# Altium project Portable Power Source V1.0.PrjPcb
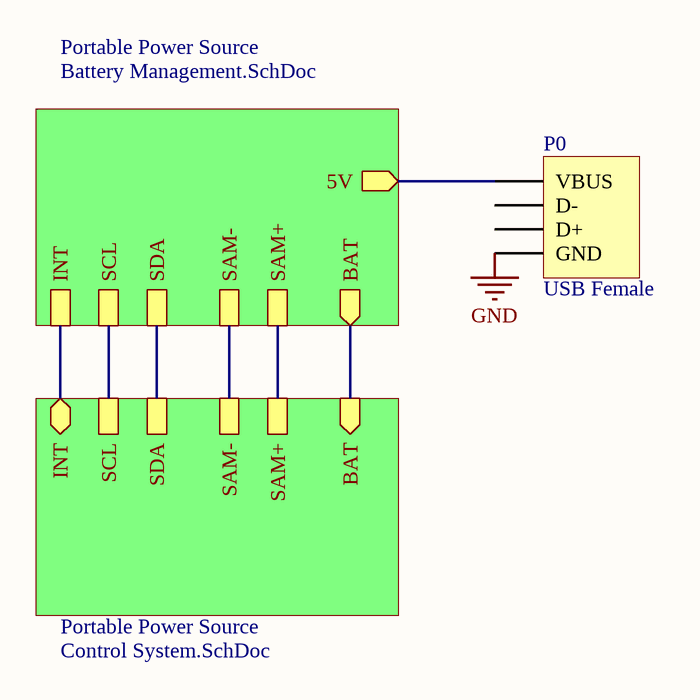
[diagram p0: Portable Power Source.SchDoc]
3 sheets, 57 parts. Net scope: hierarchical (ports join the sheet entries above them; power ports are global).
Board file: Portable Power Bank.PcbDoc
Sheets:
  Portable Power Source.SchDoc
    Portable Power Source = Battery Management.SchDoc
    Portable Power Source = Control System.SchDoc

## Sheet Portable Power Source.SchDoc
size A4

### Parts
P0  USB Female  [USB Female]

### Sub-sheets
Portable Power Source = Battery Management.SchDoc: SDA, SCL, INT, 5V (out), BAT (out), SAM-, SAM+
Portable Power Source = Control System.SchDoc: BAT (in), SCL, SDA, SAM-, SAM+, INT

### Nets
GND: P0.4(GND)
BAT: sheet Portable Power Source/BAT, sheet Portable Power Source/BAT
INT: sheet Portable Power Source/INT, sheet Portable Power Source/INT
SCL: sheet Portable Power Source/SCL, sheet Portable Power Source/SCL
SDA: sheet Portable Power Source/SDA, sheet Portable Power Source/SDA
NetC8_2: sheet Portable Power Source/SAM+, sheet Portable Power Source/SAM+
NetP0_1: P0.1(VBUS) ; sheet Portable Power Source/5V, sheet Portable Power Source/SAM-, sheet Portable Power Source/SAM-

Not connected (* = marked no-connect by the designer): P0 2(D-) 3(D+)

## Sheet Battery Management.SchDoc
size A4
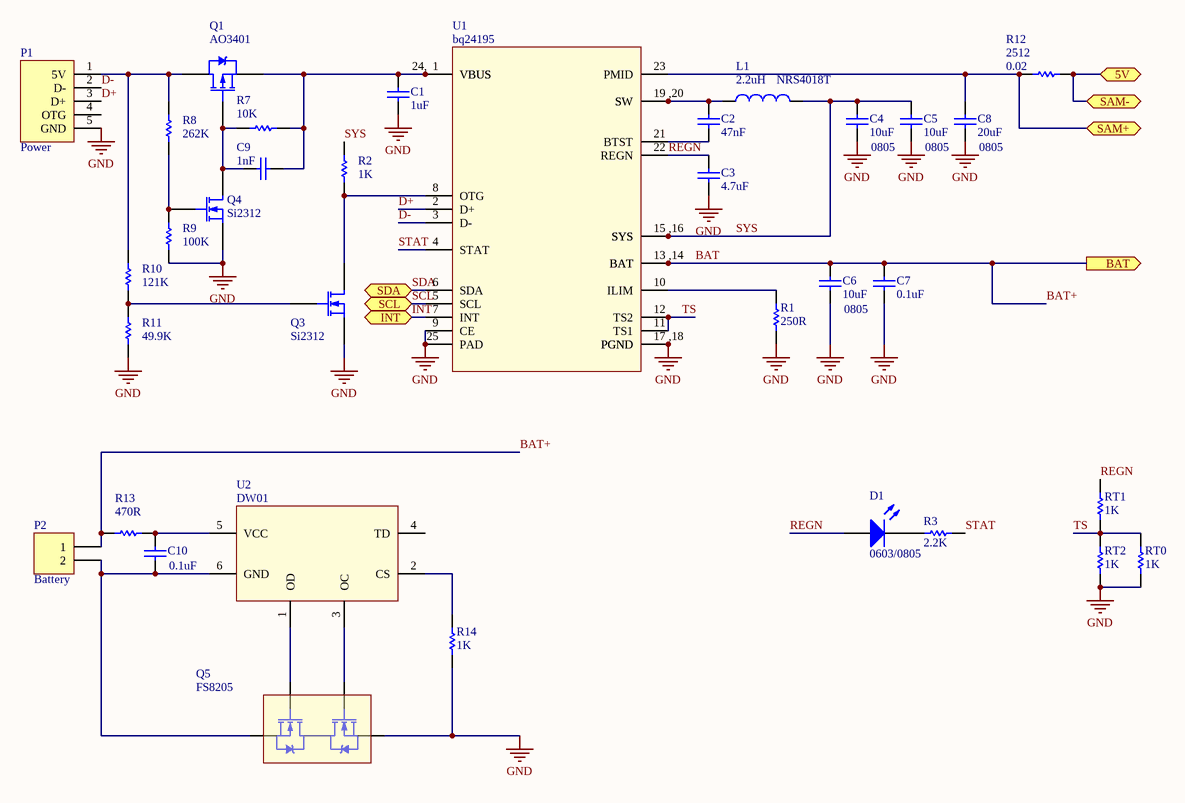
[diagram p1: Battery Management.SchDoc]

### Parts
(Parts that share a designator on the sheet are numbered #1, #2 ... from top to bottom, then left to right.)
C1#1  value 1uF  [D0805]  (hidden comment: 0603)
C2#1  value 47nF  [D0805]  (hidden comment: 0603)
C3#1  value 4.7uF  [D0603]  (hidden comment: 0603)
C4#1  0805  value 10uF  [D0805]
C5  0805  value 10uF  [D0805]
C6  0805  value 10uF  [D0805]
C7  value 0.1uF  [D0603]  (hidden comment: 0603)
C8  0805  value 20uF  [D0805]
C9  value 1nF  [D0603]  (hidden comment: 0603)
C10  value 0.1uF  [D0603]  (hidden comment: 0603)
D1#1  0603/0805  [D0805_Diode]
L1  value 2.2uH  CommentType: NRS4018T  [INDUCTOR.4040]  (hidden comment: Inductor)
P1#1  Power  [Micro.Horn]
P2  Battery  [BAT_RECT]
Q1  AO3401  [SOT23]
Q3  Si2312  [SOT23]
Q4  Si2312  [SOT23]
Q5  FS8205  [SOT23-6_N]
R1#1  value 250R  [D0603]  (hidden comment: 0603)
R2#1  value 1K  [D0603]  (hidden comment: 0603)
R3#1  value 2.2K  [D0603]  (hidden comment: 0603)
R7#1  value 10K  [D0603]  (hidden comment: 0603)
R8#1  value 262K  [D0603]  (hidden comment: 0603)
R9#1  value 100K  [D0603]  (hidden comment: 0603)
R10#1  value 121K  [D0603]  (hidden comment: 0603)
R11  value 49.9K  [D0603]  (hidden comment: 0603)
R12  2512  value 0.02  [D1206]
R13  value 470R  [D0603]  (hidden comment: 0603)
R14  value 1K  [D0603]  (hidden comment: 0603)
RT0  value 1K  [D0603]  (hidden comment: 0603)
RT1  value 1K  [D0603]  (hidden comment: 0603)
RT2  value 1K  [D0603]  (hidden comment: 0603)
U1#1  bq24195  [QFN24]
U2#1  DW01  [SOT23-6_N]

### Ports
5V, BAT (out), INT, SAM+, SAM-, SCL, SDA

### Nets
GND: C1#1.1 C3#1.1 C4#1.1 C5.1 C6.1 C7.1 C8.1 P1#1.5(GND) Q3.3(S) Q4.3(S) Q5.3(S2) R1#1.1 R9#1.1 R11.1 R14.1 RT0.1 RT2.1 U1#1.9(CE) U1#1.17(PGND) U1#1.18(PGND) U1#1.25(PAD)
BAT: C6.2 C7.2 P2.1 R13.1 U1#1.13(BAT) U1#1.14(BAT) ; port BAT  [also labelled BAT+]
D+: P1#1.3(D+) U1#1.2(D+)
D-: P1#1.2(D-) U1#1.3(D-)
INT: U1#1.7(INT) ; port INT
REGN: C3#1.2 D1#1.1(A) RT1.2 U1#1.22(REGN)
SCL: U1#1.5(SCL) ; port SCL
SDA: U1#1.6(SDA) ; port SDA
STAT: R3#1.1 U1#1.4(STAT)
SYS: C4#1.2 C5.2 L1.2 R2#1.2 U1#1.15(SYS) U1#1.16(SYS)
TS: RT0.2 RT1.1 RT2.2 U1#1.11(TS1) U1#1.12(TS2)
NetC1#1_2: C1#1.2 C9.1 Q1.3(S) R7#1.1 U1#1.1(VBUS) U1#1.24(VBUS)
NetC2#1_1: C2#1.1 U1#1.21(BTST)
NetC2#1_2: C2#1.2 L1.1 U1#1.19(SW) U1#1.20(SW)
NetC8_2: C8.2 R12.2 U1#1.23(PMID) ; port SAM+
NetC9_2: C9.2 Q1.1(G) Q4.2(D) R7#1.2
NetC10_1: C10.1 P2.2 Q5.1(S1) U2#1.6(GND)
NetC10_2: C10.2 R13.2 U2#1.5(VCC)
NetD1#1_2: D1#1.2(K) R3#1.2
NetP0_1: R12.1 ; port 5V, port SAM-
NetP1#1_1: P1#1.1(5V) Q1.2(D) R8#1.2 R10#1.2
NetQ3_1: Q3.1(G) R10#1.1 R11.2
NetQ3_2: Q3.2(D) R2#1.1 U1#1.8(OTG)
NetQ4_1: Q4.1(G) R8#1.1 R9#1.2
NetQ5_4: Q5.4(G2) U2#1.3(OC)
NetQ5_6: Q5.6(G1) U2#1.1(OD)
NetR1#1_2: R1#1.2 U1#1.10(ILIM)
NetR14_2: R14.2 U2#1.2(CS)

Not connected (* = marked no-connect by the designer): P1#1 4(OTG); Q5 2(D12) 5(D12); U2#1 4(TD)

### Notes on the sheet
- (in symbol bq24195) 24,; ,20; ,16; ,14; ,18

### Library data of the parts
C1#1 C2#1 C3#1 C4#1 C5-C10 = Cap: Capacitor; Published: 8-Jun-2000; LatestRevisionDate: 17-Jul-2002; LatestRevisionNote: Re-released for DXP Platform.; PackageReference: RAD-0.3; Publisher: Altium Limited; PackageDescription: Radial Cap, Thru-Hole; 2 Leads; 0.3 in Pin Spacing
D1#1 = LED0: Typical INFRARED GaAs LED; Published: 8-Jun-2000; LatestRevisionDate: 08-Jul-2005; LatestRevisionNote: Mech Layer 1 removed.; PackageReference: LED-0; Publisher: Altium Limited; PackageDescription: LED; 2 Leads
L1 = Inductor: Code_IEC: 1005; Published: 8-Jun-2000; LatestRevisionDate: 29-May-2009; LatestRevisionNote: IPC-7351 Footprint Added.; PackageReference: 0402-A; Publisher: Altium Limited; PackageDescription: Chip Inductor; Code_JEITA: 0402
P1#1 = Micro USB Horn: MIcro USB Connector Horn
P2 = Header 2: Header, 2-Pin; LatestRevisionDate: 17-Jul-2002; LatestRevisionNote: Re-released for DXP Platform.; Publisher: Altium Limited
Q1 = AO3401: AO3401 P-Channel MOSFET
Q3 Q4 = Si2312: SI2312 N-Channel MOSFEt
Q5 = FS8205: FS8205 Dual MOS
R1#1 R2#1 R3#1 R7#1 R8#1 R9#1 R10#1 R11-R14 RT0-RT2 = Res1: Resistor; Published: 8-Jun-2000; LatestRevisionDate: 17-Jul-2002; LatestRevisionNote: Re-released for DXP Platform.; PackageReference: AXIAL-0.3; Publisher: Altium Limited; PackageDescription: Axial Device, Thru-Hole; 2 Leads; 0.3 in Pin Spacing
U1#1 = bq24195: A Battery charger manager published by Ti
U2#1 = DW01: Battery Protector

## Sheet Control System.SchDoc
size A4
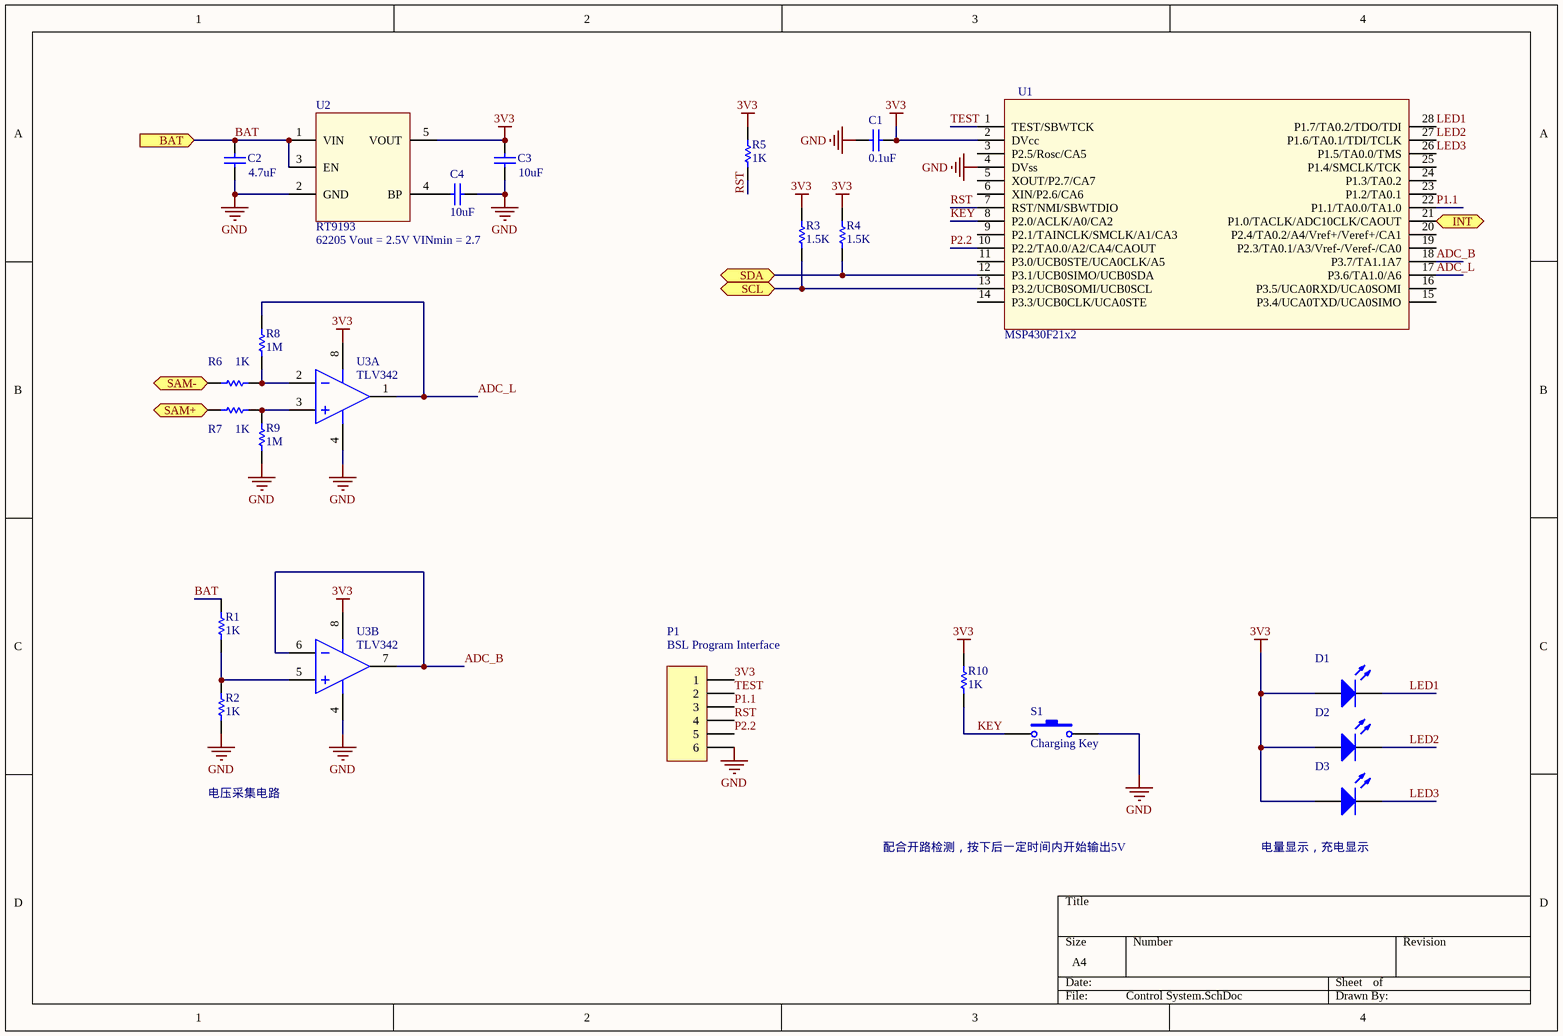
[diagram p2: Control System.SchDoc]

### Parts
(Parts that share a designator on the sheet are numbered #1, #2 ... from top to bottom, then left to right.)
C1#2  value 0.1uF  [D0603]  (hidden comment: 0603)
C2#2  value 4.7uF  [D0603]  (hidden comment: 0603)
C3#2  value 10uF  [D0603]  (hidden comment: 0603)
C4#2  value 10uF  [D0603]  (hidden comment: 0603)
D1#2  0603/0805  [D0805_Diode]  (value not drawn)
D2  0603/0805  [D0805_Diode]  (value not drawn)
D3  0603/0805  [D0805_Diode]  (value not drawn)
P1#2  BSL Program Interface  [HDR1X6]
R1#2  value 1K  [D0603]  (hidden comment: 0603)
R2#2  value 1K  [D0603]  (hidden comment: 0603)
R3#2  value 1.5K  [D0603]  (hidden comment: 0603)
R4  value 1.5K  [D0603]  (hidden comment: 0603)
R5  value 1K  [D0603]  (hidden comment: 0603)
R6  value 1K  [D0603]  (hidden comment: 0603)
R7#2  value 1K  [D0603]  (hidden comment: 0603)
R8#2  value 1M  [D0603]  (hidden comment: 0603)
R9#2  value 1M  [D0603]  (hidden comment: 0603)
R10#2  value 1K  [D0603]  (hidden comment: 0603)
S1  Charging Key  [SW_A]
U1#2  MSP430F21x2  [TSSOP28]
U2#2  RT9193  [SC70-5]
U3  TLV342  [TSSOP8]  (parts A,B of 2)

### Ports
BAT (in), INT, SAM+, SAM-, SCL, SDA

### Nets
3V3: C1#2.2 C3#2.2 D1#2.1(A) D2.1(A) D3.1(A) P1#2.1 R3#2.2 R4.2 R5.1 R10#2.1 U1#2.2(DVcc) U2#2.5(VOUT) U3.8(V+)
GND: C1#2.1 C2#2.1 C3#2.1 C4#2.1 P1#2.6 R2#2.1 R9#2.1 S1.2 U1#2.4(DVss) U2#2.2(GND) U3.4(V-)
ADC_B: U1#2.18(P3.7/TA1.1A7) U3.6(IN-) U3.7(OUT)
ADC_L: R8#2.2 U1#2.17(P3.6/TA1.0/A6) U3.1(OUT)
BAT: C2#2.2 R1#2.2 U2#2.1(VIN) U2#2.3(EN) ; port BAT
INT: U1#2.21(P1.0/TACLK/ADC10CLK/CAOUT) ; port INT
KEY: R10#2.2 S1.1 U1#2.8(P2.0/ACLK/A0/CA2)
LED1: D1#2.2(K) U1#2.28(P1.7/TA0.2/TDO/TDI)
LED2: D2.2(K) U1#2.27(P1.6/TA0.1/TDI/TCLK)
LED3: D3.2(K) U1#2.26(P1.5/TA0.0/TMS)
P1.1: P1#2.3 U1#2.22(P1.1/TA0.0/TA1.0)
P2.2: P1#2.5 U1#2.10(P2.2/TA0.0/A2/CA4/CAOUT)
RST: P1#2.4 R5.2 U1#2.7(RST/NMI/SBWTDIO)
SCL: R3#2.1 U1#2.13(P3.2/UCB0SOMI/UCB0SCL) ; port SCL
SDA: R4.1 U1#2.12(P3.1/UCB0SIMO/UCB0SDA) ; port SDA
TEST: P1#2.2 U1#2.1(TEST/SBWTCK)
NetC4#2_2: C4#2.2 U2#2.4(BP)
NetC8_2: R7#2.1 ; port SAM+
NetP0_1: R6.2 ; port SAM-
NetR1#2_1: R1#2.1 R2#2.2 U3.5(IN+)
NetR6_1: R6.1 R8#2.1 U3.2(IN-)
NetR7#2_2: R7#2.2 R9#2.2 U3.3(IN+)

Not connected (* = marked no-connect by the designer): U1#2 3(P2.5/Rosc/CA5) 5(XOUT/P2.7/CA7) 6(XIN/P2.6/CA6) 9(P2.1/TAINCLK/SMCLK/A1/CA3) 11(P3.0/UCB0STE/UCA0CLK/A5) 14(P3.3/UCB0CLK/UCA0STE) 15(P3.4/UCA0TXD/UCA0SIMO) 16(P3.5/UCA0RXD/UCA0SOMI) 19(P2.3/TA0.1/A3/Vref-/Veref-/CA0) 20(P2.4/TA0.2/A4/Vref+/Veref+/CA1) 23(P1.2/TA0.1) 24(P1.3/TA0.2) 25(P1.4/SMCLK/TCK)

### Notes on the sheet
- 62205 Vout = 2.5V VINmin = 2.7
- 电压采集电路
- 配合开路检测，按下后一定时间内开始输出5V
- (near D3) 电量显示，充电显示

### Library data of the parts
C1#2 C2#2 C3#2 C4#2 = Cap: Capacitor; Published: 8-Jun-2000; LatestRevisionDate: 17-Jul-2002; LatestRevisionNote: Re-released for DXP Platform.; PackageReference: RAD-0.3; Publisher: Altium Limited; PackageDescription: Radial Cap, Thru-Hole; 2 Leads; 0.3 in Pin Spacing
D1#2 D2 D3 = LED0: Typical INFRARED GaAs LED; Published: 8-Jun-2000; LatestRevisionDate: 08-Jul-2005; LatestRevisionNote: Mech Layer 1 removed.; PackageReference: LED-0; Publisher: Altium Limited; PackageDescription: LED; 2 Leads
P1#2 = Header 6: Header, 6-Pin; LatestRevisionDate: 17-Jul-2002; LatestRevisionNote: Re-released for DXP Platform.; Publisher: Altium Limited
R1#2 R2#2 R3#2 R4-R6 R7#2 R8#2 R9#2 R10#2 = Res1: Resistor; Published: 8-Jun-2000; LatestRevisionDate: 17-Jul-2002; LatestRevisionNote: Re-released for DXP Platform.; PackageReference: AXIAL-0.3; Publisher: Altium Limited; PackageDescription: Axial Device, Thru-Hole; 2 Leads; 0.3 in Pin Spacing
S1 = SW-PB: Switch; Published: 24-Mar-1999; LatestRevisionDate: 17-Jul-2002; LatestRevisionNote: Re-released for DXP Platform.; PackageReference: SPST-2; Publisher: Altium Limited; PackageDescription: Switch; 2 Leads
U1#2 = MSP430F21x2_PW
U2#2 = RT9193: 3V3 Voltage Regulator
U3 = LPV358: LPV358 Op Amp

## Nets that join several sheets
GND: Portable Power Source (P0.4), Battery Management (21 pins), Control System (11 pins)
BAT: Battery Management (6 pins), Control System (C2#2.2 R1#2.2 U2#2.1 U2#2.3)
INT: Battery Management (U1#1.7), Control System (U1#2.21)
NetC8_2: Battery Management (C8.2 R12.2 U1#1.23), Control System (R7#2.1)
NetP0_1: Portable Power Source (P0.1), Battery Management (R12.1), Control System (R6.2)
SCL: Battery Management (U1#1.5), Control System (R3#2.1 U1#2.13)
SDA: Battery Management (U1#1.6), Control System (R4.1 U1#2.12)